# EAGLE design ultra-violet-tooth-sensor-mk-4.0 (EAGLE 7.5.0)
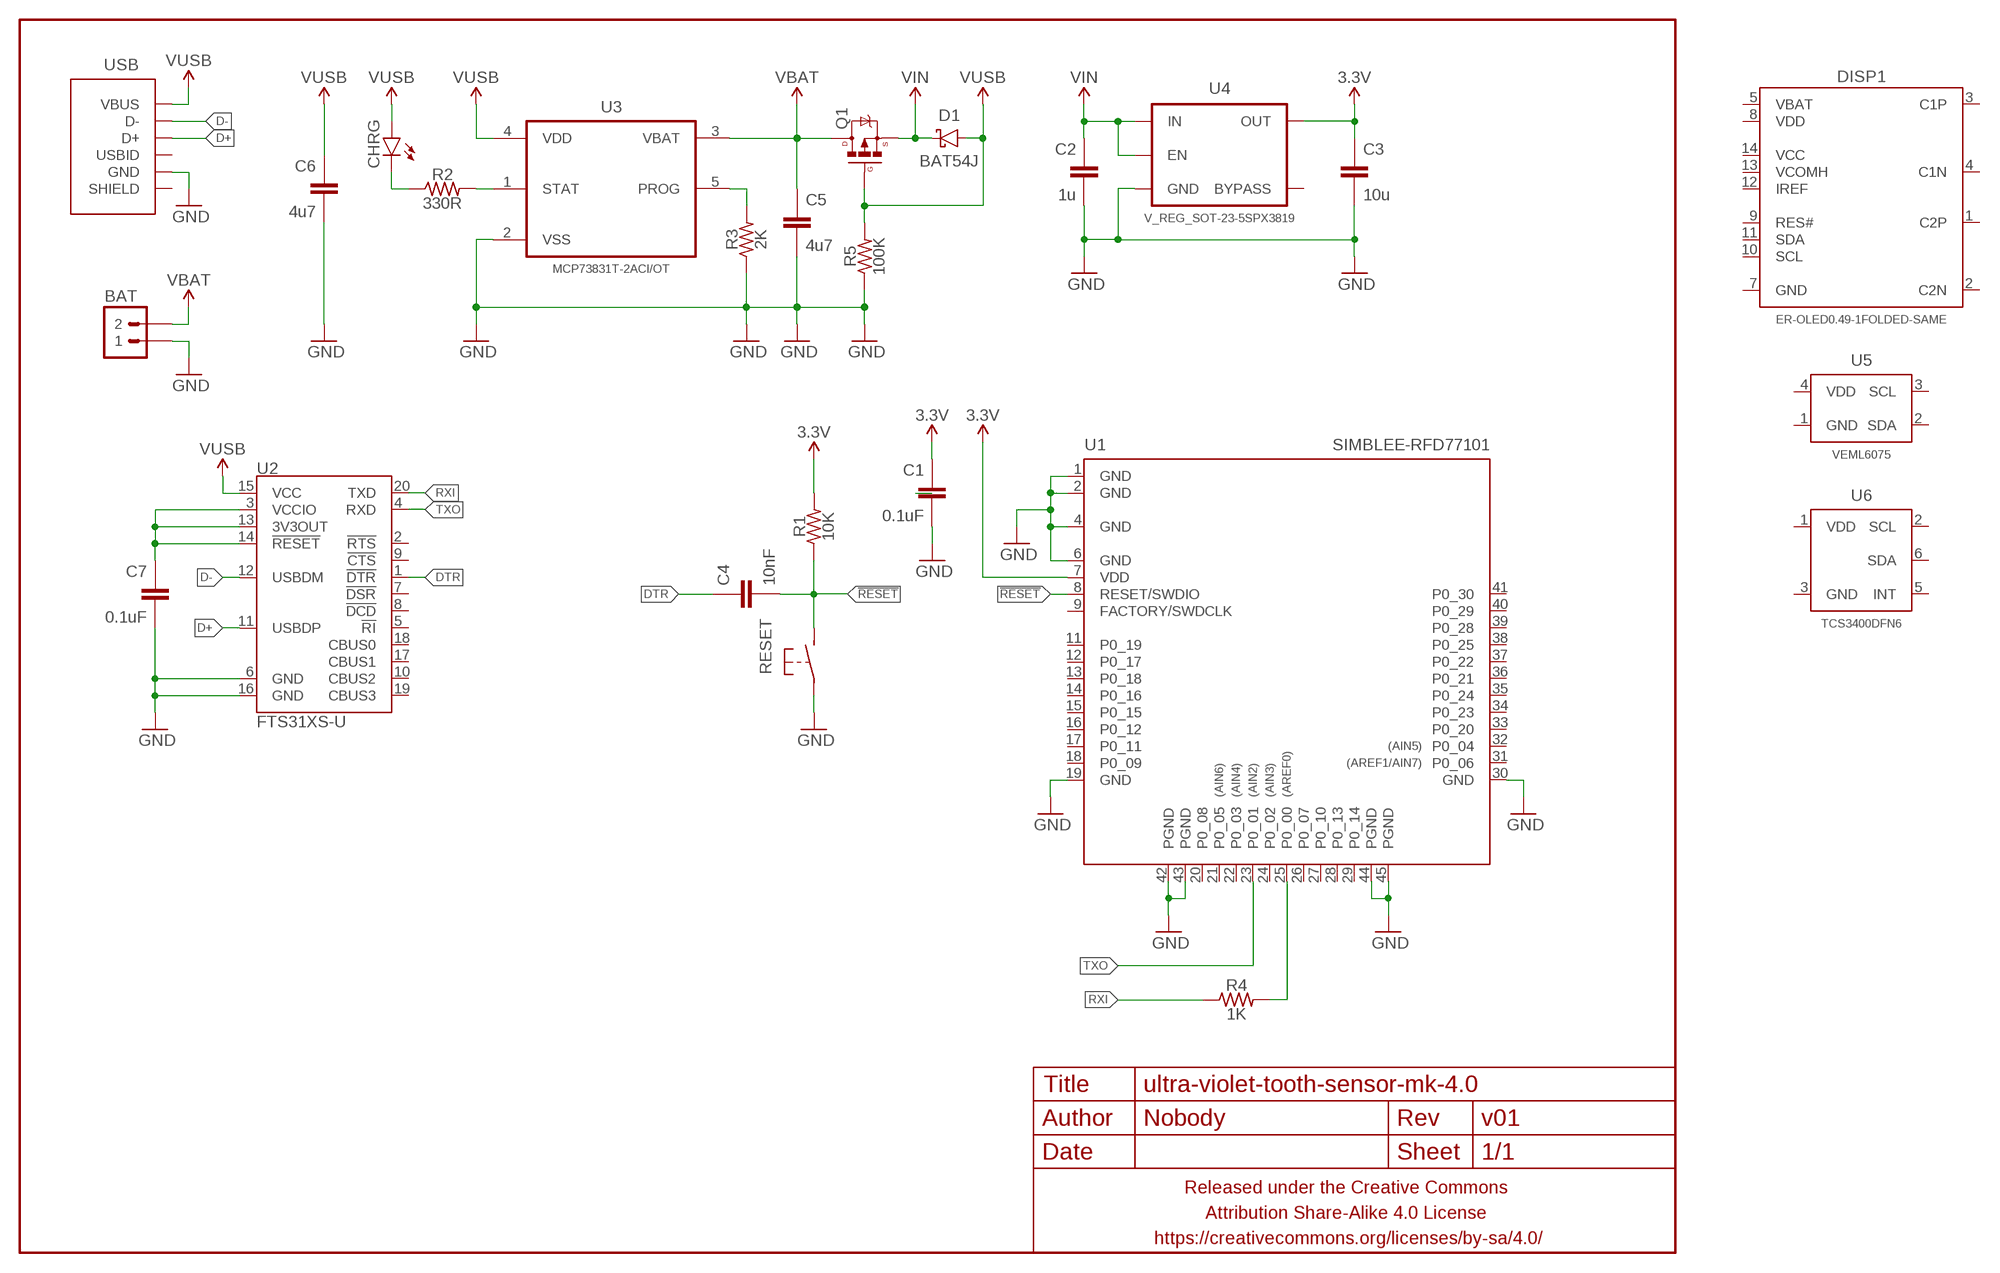
[diagram p0: schematic, sheet 1]

## Parts
BAT  M02JST-2MM-SMT  [JST-2-SMD]
C1  0.1uF  CAPACITOR-CERAMICC0402  [C0402]
C2  1u  CAPACITOR-CERAMICC0603-TIGHTER  [C0603-TIGHTER]
C3  10u  CAPACITOR-CERAMICC0603-TIGHTER  [C0603-TIGHTER]
C4  10nF  CAPACITOR-CERAMICC0402  [C0402]
C5  4u7  CAPACITOR-CERAMICC0603-TIGHTER  [C0603-TIGHTER]
C6  4u7  CAPACITOR-CERAMICC0603-TIGHTER  [C0603-TIGHTER]
C7  0.1uF  CAPACITOR-CERAMICC0402  [C0402]
CHRG  LED0603-TIGHT  [LED-0603-TIGHT]
D1  BAT54J  DIODE-SCHOTTKYSOD323  [SOD323-SCHOTTKY]
DISP1  ER-OLED0.49-1FOLDED-SAME  [ER-OLED0.49-1-FOLDED-SAME]
FRAME1  FRAME-LETTERNO_PACKAGE  [DUMMY]
Q1  MOSFET-PCHANNELSOT-23  [SOT23]
R1  10K  RESISTORR0402  [R0402]
R2  330R  RESISTORR0402  [R0402]
R3  2K  RESISTORR0402  [R0402]
R4  1K  RESISTORR0402  [R0402]
R5  100K  RESISTORR0402  [R0402]
RESET  SPST-NO-TACTSMD-TINIER  [TACTILE_SWITCH_SMD_TINY]
U1  SIMBLEE-RFD77101  [RFD77101]
U2  FTS31XS-U  FT231XS  [SSOP20_L]
U3  MCP73831T-2ACI/OT  [SOT95P280X145-5N]
U4  V_REG_SOT-23-5SPX3819  [SOT23-5]
U5  VEML6075  [OPLGA4]
U6  TCS3400DFN6  [TCS3400_DFN6]
USB  USB-AB-SHIELDFCI-10118193-USB-MICRO-B  [FCI-10118193-USB-MICRO-B]

## Nets
3.3V: C1.1 C3.1 R1.2 U1.7(VDD) U4.5(OUT)
!RESET: C4.2 R1.1 RESET.P$2 U1.8(RESET/SWDIO)
D+: U2.11(USBDP) USB.3(D+)
D-: U2.12(USBDM) USB.2(D-)
DTR: C4.1 U2.1(!DTR)
GND: BAT.2 C1.2 C2.2 C3.2 C5.2 C6.2 C7.2 R3.1 R5.1 RESET.P$1 U1.1(GND) U1.2(GND) U1.4(GND) U1.6(GND) U1.19(GND) U1.30(GND) U1.42(PGND) U1.43(PGND) U1.44(PGND) U1.45(PGND) U2.6(GND) U2.16(GND) U3.2(VSS) U4.2(GND) USB.5(GND)
N$2: CHRG.C R2.1
N$3: R4.2 U1.25(P0_00)
N$4: C7.1 U2.3(VCCIO) U2.13(3V3OUT) U2.14(!RESET)
N$5: R3.2 U3.5(PROG)
N$6: R2.2 U3.1(STAT)
RXI: R4.1 U2.20(TXD)
TXO: U1.23(P0_01) U2.4(RXD)
VBAT: BAT.1 C5.1 Q1.3(D) U3.3(VBAT)
VIN: C2.1 D1.C Q1.2(S) U4.1(IN) U4.3(EN)
VUSB: C6.1 CHRG.A D1.A Q1.1(G) R5.2 U2.15(VCC) U3.4(VDD) USB.1(VBUS)
Unconnected: DISP1.1(C2P) DISP1.2(C2N) DISP1.3(C1P) DISP1.4(C1N) DISP1.5(VBAT) DISP1.7(GND) DISP1.8(VDD) DISP1.9(RES#) DISP1.10(SCL) DISP1.11(SDA) DISP1.12(IREF) DISP1.13(VCOMH) DISP1.14(VCC) U1.9(FACTORY/SWDCLK) U1.11(P0_19) U1.12(P0_17) U1.13(P0_18) U1.14(P0_16) U1.15(P0_15) U1.16(P0_12) U1.17(P0_11) U1.18(P0_09) U1.20(P0_08) U1.21(P0_05) U1.22(P0_03) U1.24(P0_02) U1.26(P0_07) U1.27(P0_10) U1.28(P0_13) U1.29(P0_14) U1.31(P0_06) U1.32(P0_04) U1.33(P0_20) U1.34(P0_23) U1.35(P0_24) U1.36(P0_21) U1.37(P0_22) U1.38(P0_25) U1.39(P0_28) U1.40(P0_29) U1.41(P0_30) U2.2(!RTS) U2.5(!RI) U2.7(!DSR) U2.8(!DCD) U2.9(!CTS) U2.10(CBUS2) U2.17(CBUS1) U2.18(CBUS0) U2.19(CBUS3) U4.4(BYPASS) U5.1(GND) U5.2(SDA) U5.3(SCL) U5.4(VDD) U6.1(VDD) U6.2(SCL) U6.3(GND) U6.5(INT) U6.6(SDA) USB.4(USBID) USB.SHIELD@1(SHIELD) USB.SHIELD@2(SHIELD) USB.SHIELD@3(SHIELD) USB.SHIELD@4(SHIELD)

## Library data of the parts
BAT = a_parts:M02: Standard 2-pin 0.1" header. Use with - straight break away headers ( PRT-00116) - right angle break away headers (PRT-00553) - swiss pins (PRT-00743) - machine pins (PRT-00117) - female headers (PRT-00115) Molex polarized connector foot print use with: PRT-08233 with associated crimp pins and housings. 2.54_SCREWTERM for use with PRT-10571. 3.5mm Screw Terminal footprints for PRT-08084 5mm Screw Terminal footprints for use with PRT-08433; PROD_ID: CONN-08352
C1-C7 = a_parts:CAPACITOR-CERAMIC: CAPACITOR, European symbol
CHRG = a_parts:LED: LEDs Standard schematic elements and footprints for 5mm, 3mm, 1206, and 0603 sized LEDs. 5mm - Spark Fun Electronics SKU : COM-00529 (and others)
D1 = a_parts:DIODE-SCHOTTKY: Schottky diodes in SFE's production catalog BAT20J 1A 23V 0.62Vf RB751 120mA 40V 0.37Vf PMEG4005EJ 0.5A 40V 0.42Vf MBRA140 1A 40V 0.5Vf B340A 3A 40V SMA
DISP1 = a_parts:ER-OLED0.49-1
FRAME1 = A_butts:FRAME-LETTER: Schematic Frame Standard 8.5x11 US Letter frame; DESIGNER: Nobody; VERSION: v01
Q1 = a_parts:MOSFET-PCHANNEL: Generic PMOSFET IRLML2244 - TRANS-11153 (SOT-23 -20V -4.3A) (1.Gate 2.Source 3.Drain) FQP27P06 - COM-10349 <http://www.sparkfun.com/products/10349> (TO-220 -60V -27A) (1.Gate 2.Source 3.Drain)
R1-R5 = a_parts:RESISTOR: RESISTOR, American symbol
RESET = a_parts:SPST-NO-TACT
U1 = a_parts:SIMBLEE-RFD77101
U2 = a_parts:FT231X: FTDI FT231X Full Speed USB to Full-handshake UART This USB2.0 Full Speed IC offers a compact bridge to full handshake UART interfaces. The device is a UART, capable of operating up to 3MBaud, with low power consumption (8mA). The FT231X includes the complete FT-X series feature set and enables USB to be added into a system design quickly and easily over a UART interface.; PROD_ID: IC-11524
U3 = a_parts:MCP73831T-2ACI/OT: Charge Management Controller; MPN: MCP73831T-2ACI/OT; OC_FARNELL: 1332158; OC_NEWARK: 56K7045; PACKAGE: SOT-5; SUPPLIER: Microchip
U4 = a_parts:V_REG_SOT-23-5
U5 = a_parts:VEML6075
U6 = a_parts:TCS3400
USB = a_parts:USB-AB-SHIELD

## Board
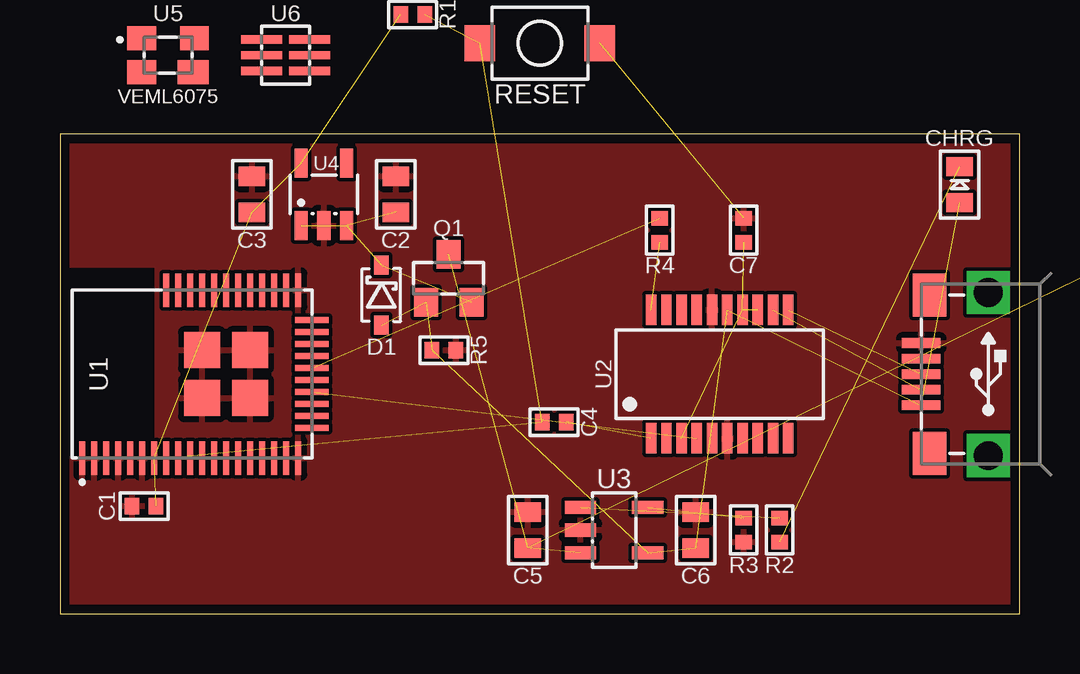
[diagram p1: board, top side]
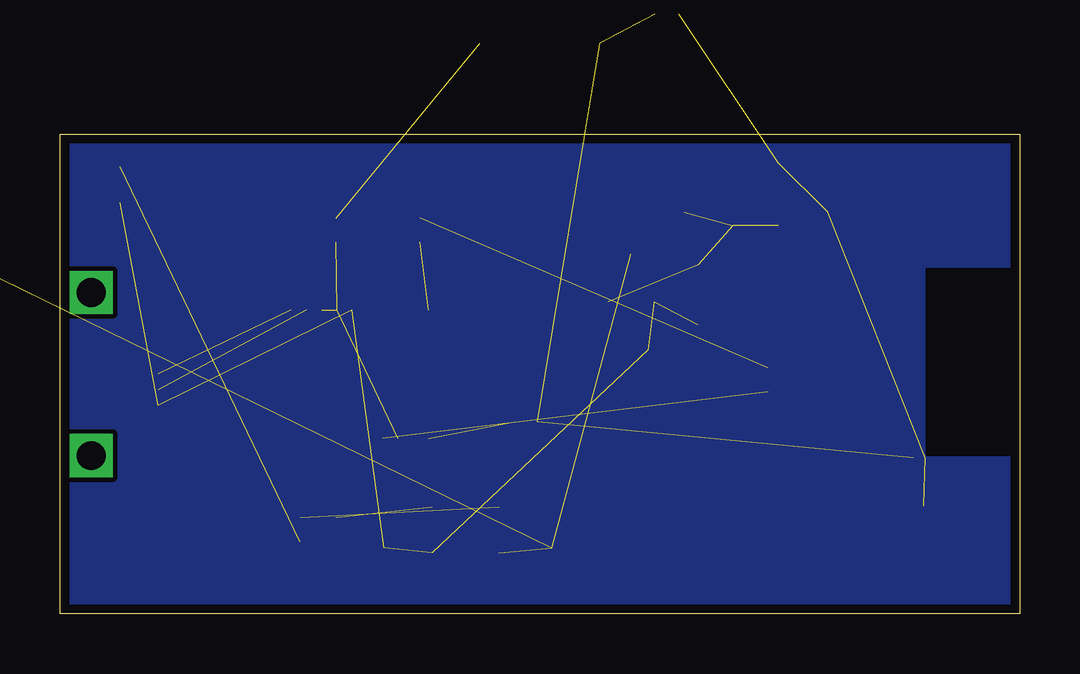
[diagram p2: board, bottom side, seen from below]

Size 40 x 20 mm. Coordinates in mm from the lower left corner, seen from the top.
Outline: 0,20 0,0 40,0 40,20 0,20
Copper layers (1*16): Top 0.0356mm / dielectric 1.5011mm / Bottom 0.0356mm
Design rules "LaenPCBOrder_2": minimum track width 6mil, minimum drill 13mil, track to track 6mil, track to pad 6mil, pad to pad 6mil, via to via 6mil, smd to smd 6mil, copper to edge 15mil, drill to drill 6mil, minimum pad ring 7mil, minimum via ring 7mil, stop-mask expansion 3mil, vias tented up to drill 20mil, thermal gap 10mil

### Footprints (pad centres in the part's own frame; a part is rotated, then mirrored left to right if it is on the bottom)
JST-2-SMD = smd 1 x 4.6: 1 -1,-3.7; 2 1,-3.7 | smd 1.6 x 3.4: NC1 -3.4,1.5; NC2 3.4,1.5
C0402 = smd 0.6 x 0.7: 1 -0.5,0; 2 0.5,0
C0603-TIGHTER = smd 0.8 x 1.1: 1 -0.75,0; 2 0.75,0
LED-0603-TIGHT = smd 0.8 x 1.1: A 0.75,0; C -0.75,0
SOD323-SCHOTTKY = smd 0.8 x 0.6: A -1.25,0; C 1.25,0
ER-OLED0.49-1-FOLDED-SAME = smd 0.35 x 3: 1 -4.55,0; 2 -3.85,0; 3 -3.15,0; 4 -2.45,0; 5 -1.75,0; 6 -1.05,0; 7 -0.35,0; 8 0.35,0; 9 1.05,0; 10 1.75,0; 11 2.45,0; 12 3.15,0; 13 3.85,0; 14 4.55,0
SOT23 = smd 1 x 1.2: 1 -0.95,-1; 2 0.95,-1; 3 0,1
R0402 = smd 0.6 x 0.7: 1 -0.5,0; 2 0.5,0
TACTILE_SWITCH_SMD_TINY = smd 1.27 x 1.5: P$1 -2.5,0; P$2 2.5,0
RFD77101 = smd 1.4 x 0.254: 1 -3.5,4.57; 2 -3.5,4.07; 3 -3.5,3.57; 4 -3.5,3.07; 5 -3.5,2.57; 6 -3.5,2.07; 7 -3.5,1.57; 8 -3.5,1.07; 9 -3.5,0.57; 10 -3.5,0.07; 11 -3.5,-0.43; 12 -3.5,-0.93; 13 -3.5,-1.43; 14 -3.5,-1.93; 15 -3.5,-2.43; 16 -3.5,-2.93; 17 -3.5,-3.43; 18 -3.5,-3.93; 19 -3.5,-4.43; 30 3.5,-4.43; 31 3.5,-3.93; 32 3.5,-3.43; 33 3.5,-2.93; 34 3.5,-2.43; 35 3.5,-1.93; 36 3.5,-1.43; 37 3.5,-0.93; 38 3.5,-0.43; 39 3.5,0.07; 40 3.5,0.57; 41 3.5,1.07 | smd 0.254 x 1.4: 20 -2.25,-5; 21 -1.75,-5; 22 -1.25,-5; 23 -0.75,-5; 24 -0.25,-5; 25 0.25,-5; 26 0.75,-5; 27 1.25,-5; 28 1.75,-5; 29 2.25,-5 | smd 1.5 x 1.5: 42 -1,-0.42; 43 -1,-2.42; 44 1,-2.42; 45 1,-0.42
SSOP20_L = smd 0.43 x 1.27: 1 -2.857,-2.68; 2 -2.223,-2.68; 3 -1.587,-2.68; 4 -0.953,-2.68; 5 -0.318,-2.68; 6 0.318,-2.68; 7 0.953,-2.68; 8 1.587,-2.68; 9 2.223,-2.68; 10 2.857,-2.68; 11 2.857,2.68; 12 2.223,2.68; 13 1.587,2.68; 14 0.953,2.68; 15 0.318,2.68; 16 -0.318,2.68; 17 -0.953,2.68; 18 -1.587,2.68; 19 -2.223,2.68; 20 -2.857,2.68
SOT95P280X145-5N = smd 1.3 x 0.55: 1 -1.4,0.95; 2 -1.4,0; 3 -1.4,-0.95; 4 1.4,-0.95; 5 1.4,0.95
SOT23-5 = smd 0.55 x 1.2: 1 -0.95,-1.3; 2 0,-1.3; 3 0.95,-1.3; 4 0.95,1.3; 5 -0.95,1.3
OPLGA4 = smd 1.2 x 1: 1 -1.1,0.7; 2 -1.1,-0.7; 4 1.1,0.7 | smd 1.3 x 1: 3 1.05,-0.7
TCS3400_DFN6 = smd 1.7 x 0.35: 1 -1,0.65; 2 -1,0; 3 -1,-0.65; 4 1,-0.65; 5 1,0; 6 1,0.65
FCI-10118193-USB-MICRO-B = smd 0.4 x 1.6: 1 -1.3,2.8; 2 -0.65,2.8; 3 0,2.8; 4 0.65,2.8; 5 1.3,2.8 | smd 1.8 x 1.4: SHIELD@1 -3.3,2.45; SHIELD@2 3.3,2.45 | drill 1.2 pad 1.8 square: SHIELD@3 -3.4,0; SHIELD@4 3.4,0

### Placement (x,y rotation side)
BAT  48.5,13.7 180 top  (outside the outline)
C1  3.5,4.5 180 top
C2  14,17.5 90 top
C3  8,17.5 90 top
C4  20.6,8 180 top
C5  19.5,3.5 90 top
C6  26.5,3.5 90 top
C7  28.5,16 90 top
CHRG  37.5,17.9 270 top
D1  13.4,13.3 90 top
DISP1  12.4,39.2 0 bottom  (outside the outline)
FRAME1  0,0 180 top
Q1  16.2,14 0 top
R1  14.7,25 180 top  (outside the outline)
R2  30,3.5 90 top
R3  28.5,3.5 90 top
R4  25,16 90 top
R5  16,11 180 top
RESET  20,23.8 180 top  (outside the outline)
U1  5.5,10 90 top
U2  27.5,10 0 top
U3  23.1,3.5 0 top
U4  11,17.5 0 top
U5  4.5,23.3 0 top
U6  9.4,23.3 0 top
USB  38.7,10 90 top

### Tracks (layer width: path | path; a pad name or v marks a point on that pad's centre or on a via)
3.3V  (4 unrouted)
!RESET  (3 unrouted)
D+  (1 unrouted)
D-  (1 unrouted)
DTR  (1 unrouted)
GND  (1 unrouted)
  pour Top (isolate 0.152, rank 6): 40,20 40,0 0,0 0,6.5 4,6.5 4,14.5 0,14.5 0,20
  pour Bottom (isolate 0.2, rank 6): 0,20 40,20 40,0 0,0 0,6.5 4,6.5 4,14.5 0,14.5
N$2  (1 unrouted)
N$3  (1 unrouted)
N$4  (3 unrouted)
N$5  (1 unrouted)
N$6  (1 unrouted)
RXI  (1 unrouted)
TXO  (1 unrouted)
VBAT  (3 unrouted)
VIN  (4 unrouted)
VUSB  (7 unrouted)